# EAGLE design miniDMXplayer (EAGLE 6.4)
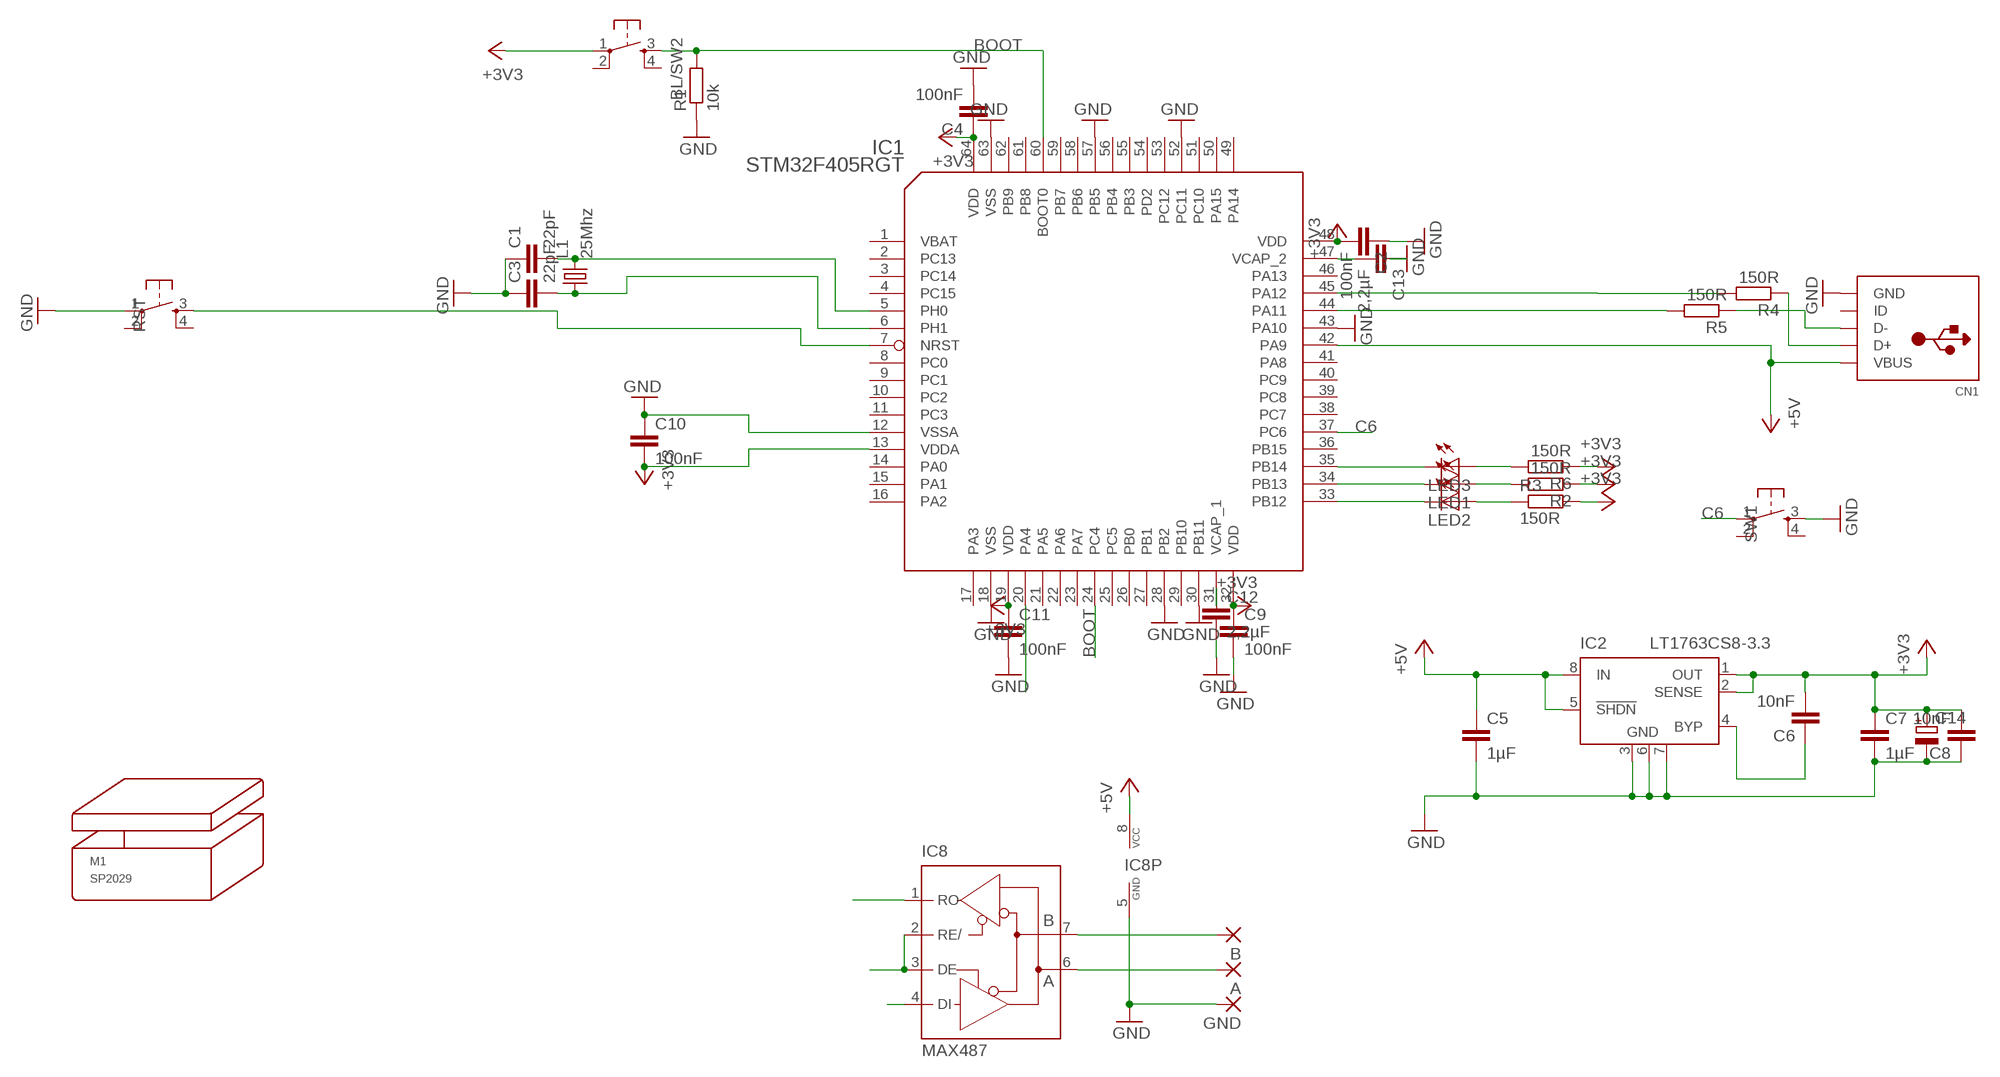
[diagram p0: schematic, sheet 1]

## Parts
A  SMD5  [SMD2,54-5,08]
B  SMD5  [SMD2,54-5,08]
BL/SW2  DTSM-6  [DTSM-6]
C1  22pF  C-EUC0402  [C0402]
C2  100nF  C-EUC0402  [C0402]
C3  22pF  C-EUC0402  [C0402]
C4  100nF  C-EUC0402  [C0402]
C5  1µF  CAP0805  [0805]
C6  10nF  C-EUC0402  [C0402]
C7  1µF  CAP0805  [0805]
C8  10nF  C-EUC0402  [C0402]
C9  100nF  C-EUC0402  [C0402]
C10  100nF  C-EUC0402  [C0402]
C11  100nF  C-EUC0402  [C0402]
C12  2,2µF  CAP0805  [0805]
C13  2,2µF  CAP0805  [0805]
C14  CPOL-EUSMCA  [SMC_A]
CN1  USBMINIB  [USB-MINIB]
GND  SMD5  [SMD2,54-5,08]
IC1  STM32F405RGT  [LQFP64]
IC2  LT1763CS8-3.3  [SOIC8]
IC8  MAX487  MAX481CSA  [SO08]
L1  25Mhz  X22-OSCILLATOR  [X22]
LED1  LED0603  [LED-0603]
LED2  LED0603  [LED-0603]
LED3  LED0603  [LED-0603]
M1  SP2029  [SP2029]
R1  10k  R-EU_R0402  [R0402]
R2  150R  R-EU_R0402  [R0402]
R3  150R  R-EU_R0402  [R0402]
R4  150R  R-EU_R0402  [R0402]
R5  150R  R-EU_R0402  [R0402]
R6  150R  R-EU_R0402  [R0402]
RST  DTSM-6  [DTSM-6]
SW1  DTSM-6  [DTSM-6]

## Nets
+3V3: BL/SW2.1 C2.2 C4.1 C6.2 C7.1 C8.2 C9.1 C10.2 C11.1 C14.+ IC1.13(VDDA) IC1.19(VDD) IC1.32(VDD) IC1.48(VDD) IC1.64(VDD) IC2.1(OUT) IC2.2(SENSE) R2.1 R3.2 R6.1
+5V: C5.1 CN1.VBUS IC1.42(PA9) IC2.5(!SHDN) IC2.8(IN) IC8.8(VCC)
A4: IC1.20(PA4)
BOOT: BL/SW2.3 IC1.24(PC4) IC1.60(BOOT0) R1.2
C6: IC1.37(PC6) SW1.1
GND: C1.1 C2.1 C3.1 C4.2 C5.2 C7.2 C8.1 C9.2 C10.1 C11.2 C12.2 C13.1 C14.- CN1.GND GND.1(P) IC1.12(VSSA) IC1.18(VSS) IC1.28(PB2) IC1.30(PB11) IC1.43(PA10) IC1.52(PC11) IC1.57(PB5) IC1.63(VSS) IC2.3(GND) IC2.6(GND) IC2.7(GND) IC8.5(GND) R1.1 RST.1 SW1.3
N$1: IC1.35(PB14) LED3.C
N$2: IC8.2(RE/) IC8.3(DE)
N$3: C3.2 IC1.6(PH1) L1.1
N$4: C1.2 IC1.5(PH0) L1.3
N$5: IC1.7(NRST) RST.3
N$6: LED3.A R6.2
N$7: IC8.1(RO)
N$8: IC8.4(DI)
N$9: B.1(P) IC8.7(B)
N$10: IC1.44(PA11) R5.2
N$11: A.1(P) IC8.6(A)
N$12: C12.1 IC1.31(VCAP_1)
N$13: C6.1 IC2.4(BYP)
N$14: C13.2 IC1.47(VCAP_2)
N$15: IC1.33(PB12) LED2.C
N$18: LED1.A R2.2
N$22: LED2.A R3.1
N$26: IC1.34(PB13) LED1.C
N$32: IC1.45(PA12) R4.2
N$39: CN1.D+ R4.1
N$40: CN1.D- R5.1
Unconnected: BL/SW2.2 BL/SW2.4 CN1.ID IC1.2(PC13) IC1.3(PC14) IC1.4(PC15) IC1.8(PC0) IC1.9(PC1) IC1.10(PC2) IC1.11(PC3) IC1.14(PA0) IC1.15(PA1) IC1.16(PA2) IC1.17(PA3) IC1.21(PA5) IC1.22(PA6) IC1.23(PA7) IC1.25(PC5) IC1.26(PB0) IC1.27(PB1) IC1.29(PB10) IC1.36(PB15) IC1.38(PC7) IC1.39(PC8) IC1.40(PC9) IC1.41(PA8) IC1.46(PA13) IC1.49(PA14) IC1.50(PA15) IC1.51(PC10) IC1.53(PC12) IC1.54(PD2) IC1.55(PB3) IC1.56(PB4) IC1.58(PB6) IC1.59(PB7) IC1.61(PB8) IC1.62(PB9) RST.2 RST.4 SW1.2 SW1.4

## Power pins joined to a net without a drawn wire
VBAT: IC1.1(VBAT)

## Library data of the parts
A B GND = wirepad:SMD5: SMD PAD
BL/SW2 RST SW1 = switch-tact:DTSM-6
C1-C4 C6 C8-C11 = rcl:C-EU: CAPACITOR, European symbol
C5 C7 C12 C13 = SparkFun:CAP: Capacitor Standard 0603 ceramic capacitor, and 0.1" leaded capacitor.
C14 = rcl:CPOL-EU: POLARIZED CAPACITOR, European symbol
CN1 = microbuilder:USB: USB Connectors USBMINIB - Surface Mount Female Mini-B USB Connector 4UConnector: 06564
IC1 = stm32:STM32F405R*T: STM32F405R*T ARM Cortex-M4 32b MCU+FPU, 210DMIPS, up to 1MB Flash/192+4KB RAM, USB OTG HS/FS, 17 TIMs, 3 ADCs, 15 comm.
IC2 = linear-technology:LT1763CS8: 500mA, Low Noise, LDO Micropower Regulators Source: http://cds.linear.com/docs/Datasheet/1763ff.pdf; MPN: LT1763CS8-3.3; OC_FARNELL: 1273617; OC_NEWARK: 57M6055
IC8 = maxim:MAX481CSA: RS485 TRANSEIVER; MF: MAXIM; MPN: MAX481CSA; OC_FARNELL: unknown; OC_NEWARK: 90C3817
L1 = seb:X22-OSCILLATOR
LED1-LED3 = SparkFun-LED:LED: LEDs Standard schematic elements and footprints for 5mm, 3mm, 1206, and 0603 sized LEDs. 5mm - Spark Fun Electronics SKU : COM-00529 (and others)
M1 = strapubox:SP2029: Gehäuse Strapubox Typ 2029 max. Bauteilhöhe, top-layer: 11,5 mm max. Bauteilhöhe, bottom-layer: 3,5 mm (Dicke der LP: 1,5 mm) Außenmaße: Länge: 80 mm Breite: 61 mm Höhe: 20,5 mm
R1-R6 = rcl:R-EU_: RESISTOR, European symbol

## Board
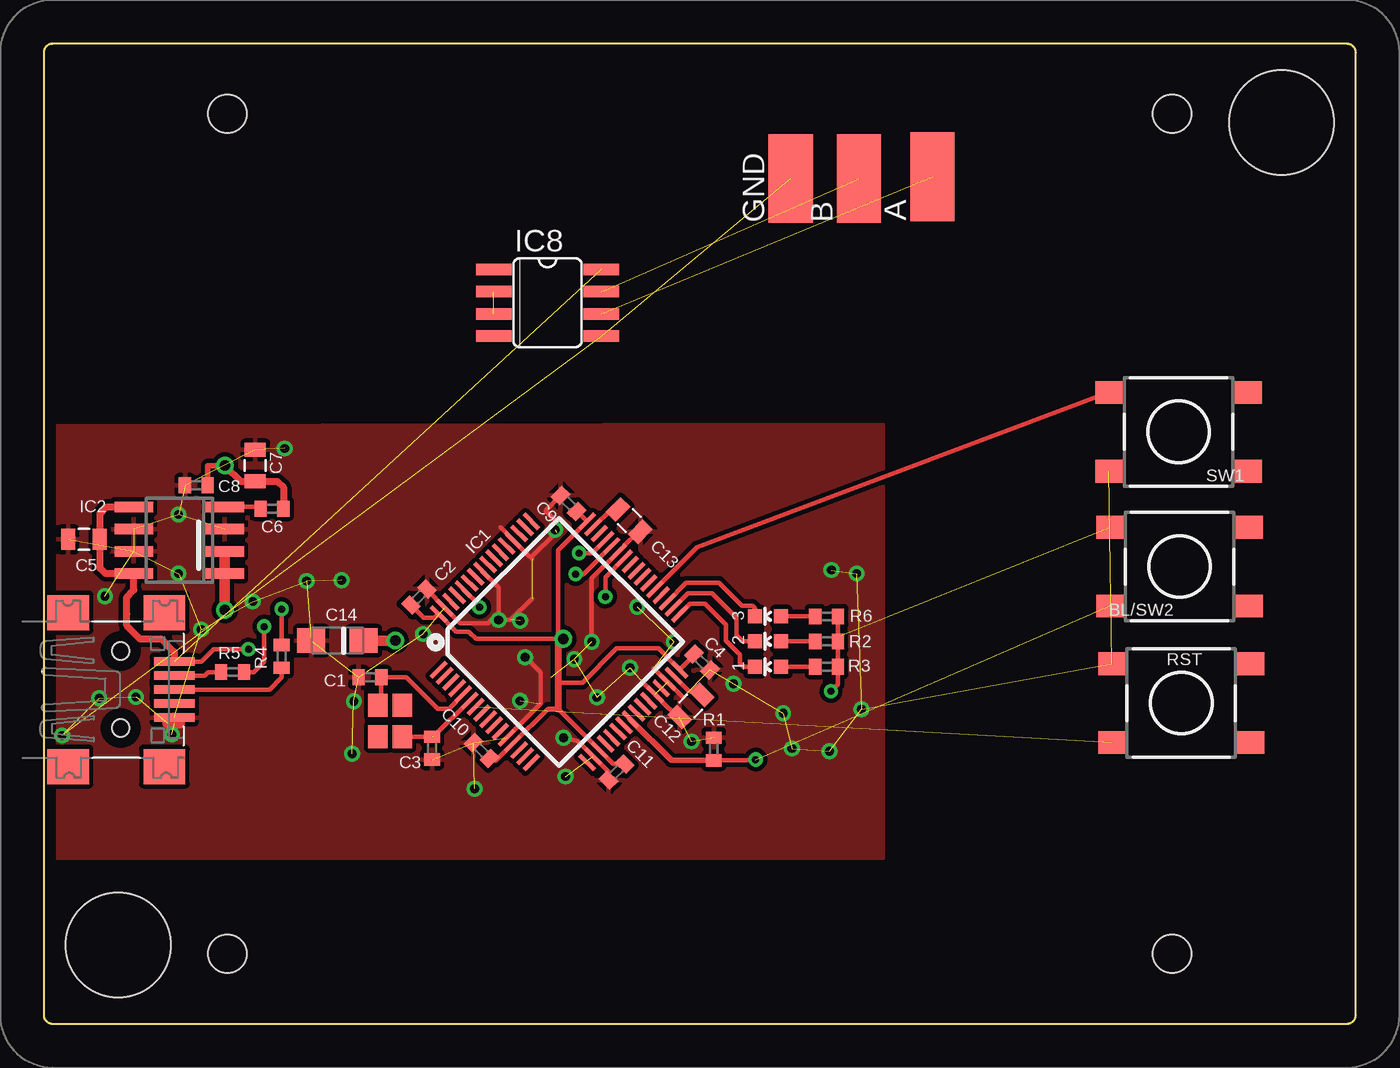
[diagram p1: board, top side]
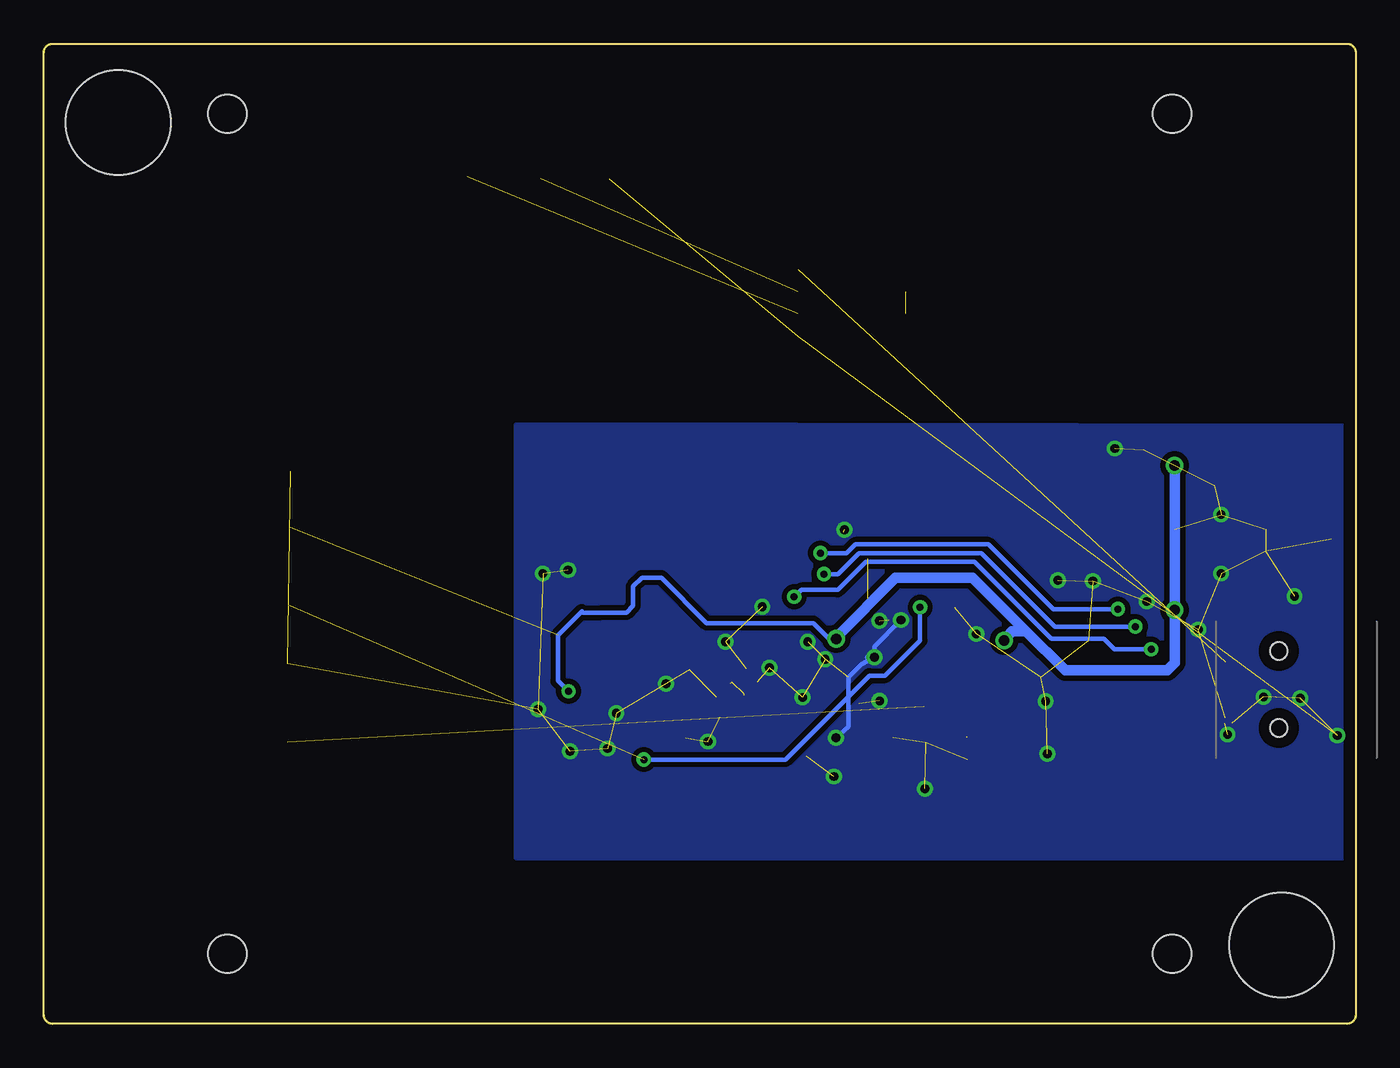
[diagram p2: board, bottom side, seen from below]

Size 75 x 56 mm. Coordinates in mm from the lower left corner, seen from the top.
Copper layers (1*16): Top 0.035mm / dielectric 1.5mm / Bottom 0.035mm
Design rules "default *": minimum track width 9mil, minimum drill 0.4mm, track to track 8mil, track to pad 8mil, pad to pad 8mil, via to via 8mil, smd to smd 8mil, copper to edge 25mil, drill to drill 8mil, minimum pad ring 10mil, minimum via ring 8mil, stop-mask expansion 4mil, vias tented up to drill 40mil, thermal gap 10mil

### Footprints (pad centres in the part's own frame; a part is rotated, then mirrored left to right if it is on the bottom)
SMD2,54-5,08 = smd 2.54 x 5.08: 1 0,0
DTSM-6 = smd 1.55 x 1.3: 1 -3.975,2.25; 2 3.975,2.25; 3 -3.975,-2.25; 4 3.975,-2.25
C0402 = smd 0.7 x 0.9: 1 -0.65,0; 2 0.65,0
0805 = smd 0.8 x 1.2: 1 -0.9,0; 2 0.9,0
SMC_A = smd 1.6 x 1.4: + -1.5,0; - 1.5,0
USB-MINIB = smd 0.5 x 2.308: D+ 0,4.064; D- -0.8,4.064; GND 1.6,4.064; ID 0.8,4.064; VBUS -1.6,4.064 | smd 2 x 2.4: GND1 -4.4,-2; GND2 -4.4,3.5; GND3 4.4,3.5; GND4 4.4,-2 | hole 1: -2.2,1; 2.2,1
LQFP64 = smd 0.24 x 1.2: 1 -3.75,-6; 2 -3.25,-6; 3 -2.75,-6; 4 -2.25,-6; 5 -1.75,-6; 6 -1.25,-6; 7 -0.75,-6; 8 -0.25,-6; 9 0.25,-6; 10 0.75,-6; 11 1.25,-6; 12 1.75,-6; 13 2.25,-6; 14 2.75,-6; 15 3.25,-6; 16 3.75,-6; 33 3.75,6; 34 3.25,6; 35 2.75,6; 36 2.25,6; 37 1.75,6; 38 1.25,6; 39 0.75,6; 40 0.25,6; 41 -0.25,6; 42 -0.75,6; 43 -1.25,6; 44 -1.75,6; 45 -2.25,6; 46 -2.75,6; 47 -3.25,6; 48 -3.75,6 | smd 1.2 x 0.24: 17 6,-3.75; 18 6,-3.25; 19 6,-2.75; 20 6,-2.25; 21 6,-1.75; 22 6,-1.25; 23 6,-0.75; 24 6,-0.25; 25 6,0.25; 26 6,0.75; 27 6,1.25; 28 6,1.75; 29 6,2.25; 30 6,2.75; 31 6,3.25; 32 6,3.75; 49 -6,3.75; 50 -6,3.25; 51 -6,2.75; 52 -6,2.25; 53 -6,1.75; 54 -6,1.25; 55 -6,0.75; 56 -6,0.25; 57 -6,-0.25; 58 -6,-0.75; 59 -6,-1.25; 60 -6,-1.75; 61 -6,-2.25; 62 -6,-2.75; 63 -6,-3.25; 64 -6,-3.75
SOIC8 = smd 0.6 x 2.2: 1 -1.905,-2.6; 2 -0.635,-2.6; 3 0.635,-2.6; 4 1.905,-2.6; 5 1.905,2.6; 6 0.635,2.6; 7 -0.635,2.6; 8 -1.905,2.6
SO08 = smd 0.66 x 2.032: 1 -1.905,-3.073; 2 -0.635,-3.073; 3 0.635,-3.073; 4 1.905,-3.073; 5 1.905,3.073; 6 0.635,3.073; 7 -0.635,3.073; 8 -1.905,3.073
X22 = smd 1.3 x 1.1: 1 0.9,0.7; 2 -0.9,0.7; 3 -0.9,-0.7; 4 0.9,-0.7
LED-0603 = smd 0.8 x 0.8: A 0,-0.75; C 0,0.75
SP2029 = hole 2.2: -27,-24; -27,24; 27,24; 27,-24 | hole 6: 33.25,23.5; -33.25,-23.5
R0402 = smd 0.7 x 0.9: 1 -0.65,0; 2 0.65,0

### Placement (x,y rotation side)
A  50.8,48.4 0 top
B  46.6,48.3 0 top
BL/SW2  64.93,26.12 0 top
C1  18.65,19.8 0 top
C2  21.44,24.39 225 top
C3  22.2,15.75 90 top
C4  37.63,20.67 315 top
C5  2.3,27.68 180 top
C6  13.05,29.43 0 top
C7  12.1,31.9 90 top
C8  8.72,30.77 0 top
C9  30,29.73 135 top
C10  25.02,15.61 315 top
C11  32.74,14.39 225 top
C12  36.99,18.16 225 top
C13  33.46,28.75 135 top
C14  16.8,21.9 180 top
CN1  3.4,19.1 270 top
GND  42.7,48.3 0 top
IC1  29.46,21.82 315 top
IC2  7.75,27.62 90 top
IC8  28.8,41.2 270 top
L1  19.8,17.3 270 top
LED1  41.39,21.85 90 top
LED2  41.39,20.4 90 top
LED3  41.39,23.27 90 top
M1  37.5,28 0 top
R1  38.3,15.7 270 top
R2  44.74,21.85 180 top
R3  44.74,20.4 0 top
R4  13.6,21 90 top
R5  10.8,20.1 0 top
R6  44.74,23.27 180 top
RST  65.03,18.32 0 top
SW1  64.87,33.83 0 top

### Tracks (layer width: path | path; a pad name or v marks a point on that pad's centre or on a via)
+3V3  (via drill 0.4, 0.6)  (1 unrouted)
  Top 0.254: C9.1 30.5,29.27 IC1.48 29.4,27.07 29.4,22 | C4.1 37.07,20.94 IC1.32 35.14,21.45 32.75,21.45 30.8,19.5 29.4,19.5 | C11.1 32.55,14.85 IC1.19 29.4,18 28.82,18 IC1.13 25.84,15.02 C10.2 | C2.2 21.71,23.2 22.35,23.2 IC1.64 23.58,22.4 24.3,22.4 24.7,22 v29.7,22 | R6.1 R2.1 R3.2 45.39,19.39 v45,19
  Top 0.305: C8.2 9.37,31.9 v10.35,31.9 | v29.7,22 29.4,22
  Top 0.406: C6.2 13.7,30.65 13.35,31 C7.1 11.25,31 v10.35,31.9 | 29.4,22 29.4,19.5 29.4,18
  Top 0.61: v10.35,23.65 IC2.1 IC2.2 | v10.35,31.9 10.37,31.93 | C14.+ 19.3,21.9 v20.1,21.9
  Bottom 0.254: v29.7,22 30.1,22 31,22.9 37.1,22.9 39.7,25.5 40.8,25.5 41.3,25 41.3,23.9 41.7,23.5 43.14,23.5 44.18,23.5 44.24,23.56 45.6,22.2 45.6,19.6 v45,19
  Bottom 0.61: v29.7,22 29.7,22.1 26.3,25.5 21.9,25.5 18.86,22.43 | 18.86,22.43 16.6,20.2 10.77,20.2 10.35,20.62 v10.35,23.65 v10.35,31.9 | v20.1,21.9 19.66,22.44 18.86,22.43
+5V  (via drill 0.4)  (1 unrouted)
  Top 0.254: IC1.42 32.1,25.52 v32.1,24.4 | v11.7,21.4 9.7,21.4 9,20.7 CN1.VBUS
  Top 0.406: IC2.5 3.6,29.53 3.22,29.15 3.22,27.65 | 3.22,27.65 3.22,26.02 3.53,25.72 IC2.8 5.15,24.8 4.75,24.38 4.75,23.43 4.75,22.75 5.5,22 6.7,22 7.46,21.24 CN1.VBUS | C5.1 3.2,27.65 3.22,27.65
  Bottom 0.254: v32.1,24.4 31.7,24.8 29.6,24.8 28,26.4 21.8,26.4 17.4,22 14.4,22 13.8,21.4 v11.7,21.4
BOOT  (via drill 0.4)  (1 unrouted)
  Top 0.254: IC1.60 24.9,23.91 v24.9,23.8 | 39.85,15.05 R1.2 40.65,15.05 v40.7,15.1
  Top 0.305: IC1.24 35.88,15.05 R1.2
  Bottom 0.254: v24.9,23.8 24.9,21.9 26.9,19.9 27.8,19.9 32.6,15.1 v40.7,15.1
C6
  Top 0.254: IC1.37 37.34,27.23 SW1.1
GND  (via drill 0.5)  (56 unrouted)
  Top 0.254: C11.2 32.28,14.41 IC1.18 30.54,16.15 v29.72,16.35 | C2.1 21.9,24.79 IC1.63 23.79,22.9 25.4,22.9 25.57,23.07 v25.99,23.07 | IC1.12 28.4,18.29 28.4,20.1 27.52,20.98 v27.52,20.95 | IC1.57 25.99,24.94 v25.99,23.07 | 27.78,26.68 27.9,26.57 | 27.78,26.68 IC1.52 26.11,28.36 | 27.9,24.3 26.67,23.07 v25.99,23.07 | C9.2 28.7,29.35 28.7,29.3 29.3,28.7 29.3,28.1 27.88,26.68 27.78,26.68 | IC1.28 35.66,18.1 C12.2 | 36.53,18.65 IC1.30 | C13.1 33.52,27.66 IC1.43 31.32,25.46 v31.32,21.82 | CN1.GND 7.5,17.46 7.5,17.18 | 34.24,19.52 34.96,18.8 | 35.73,19.45 34.85,20.33
  Top 0.61: 7.77,17.18 7.5,17.18 7.09,17.18
  Bottom 0.254: v29.72,16.35 29,16.97 29,19.8 28.25,20.55 v27.52,20.95 | v25.99,23.07 27.52,21.55 v27.52,20.95 | v27.52,20.95 27.95,20.95
  other vias: 46.74,17.98 42.77,15.72 42.27,17.75 46.47,25.73 3.17,18.6 5.27,18.68 7.7,25.73 7.7,29.1 15.02,25.3 17.72,18.43 11.95,24.12 17.02,25.35 1.05,16.48 13.77,32.88 9,22.52 44.92,15.57 27.22,23.02 30.32,20.82 33.92,23.82 36.02,21.82 39.42,19.43 45.02,25.93 29.82,14.12 24.62,13.43 17.62,15.43 7.32,16.52 29.22,28.23 21.7,22.27 37.02,16.12 3.5,24.43 27.22,18.45 31.62,18.65 33.52,20.35
  pour Top (isolate 0.254): -0.05,9.5 47.97,9.47 47.97,34.23 -0.15,34.15
  pour Bottom (isolate 0.305): -0.08,9.5 47.97,9.47 47.97,34.23 -0.18,34.15
N$1
  Top 0.254: LED3.C 40.64,23.76 40.5,23.9 39.9,23.9 38.6,25.2 36.73,25.2 IC1.35
N$2  (1 unrouted)
N$3  (1 unrouted)
  Top 0.254: IC1.6 22.27,16.4 L1.1
N$4
  Top 0.254: IC1.5 23.16,18 22.5,18 20.7,19.8 C1.2 19.3,18.4 L1.3
N$5  (1 unrouted)
N$6
  Top 0.254: LED3.A R6.2
N$9  (1 unrouted)
N$10  (via drill 0.4)
  Top 0.254: IC1.44 30.86,25.7 v30.4,25.7 | v12.6,22.7 12.6,20.7 12,20.1 R5.2
  Bottom 0.254: v30.4,25.7 29.6,25.7 28.4,26.9 21.4,26.9 17.2,22.7 v12.6,22.7
N$11  (1 unrouted)
N$12
  Top 0.254: IC1.31 36.87,19.02 C12.1
N$13
  Top 0.254: IC2.4 12.38,29.53 C6.1
N$14
  Top 0.254: IC1.47 32.45,29.41 C13.2
N$15
  Top 0.254: IC1.33 36.94,24 37.8,24 39,22.8 39,21.9 39.8,21.1 39.8,20.6 40,20.4 LED2.C
N$18
  Top 0.254: LED1.A R2.2
N$22
  Top 0.254: LED2.A R3.1
N$26
  Top 0.254: IC1.34 36.83,24.6 38.2,24.6 39.6,23.2 39.6,22.2 39.95,21.85 LED1.C
N$32  (via drill 0.4)
  Top 0.254: IC1.45 31.35,26.9 v30.6,26.9 | R4.2 v13.6,23.7
  Bottom 0.254: v30.6,26.9 29.1,26.9 28.6,27.4 21,27.4 17.3,23.7 v13.6,23.7
N$39
  Top 0.254: CN1.D+ 12.9,19.1 13.6,19.8 R4.1
N$40
  Top 0.254: CN1.D- 9.2,19.9 9.4,20.1 R5.1

### Text on the board
tNames: 3 | 2 | 1